# EAGLE design TTGO_shield_revD (EAGLE 9.0.1)
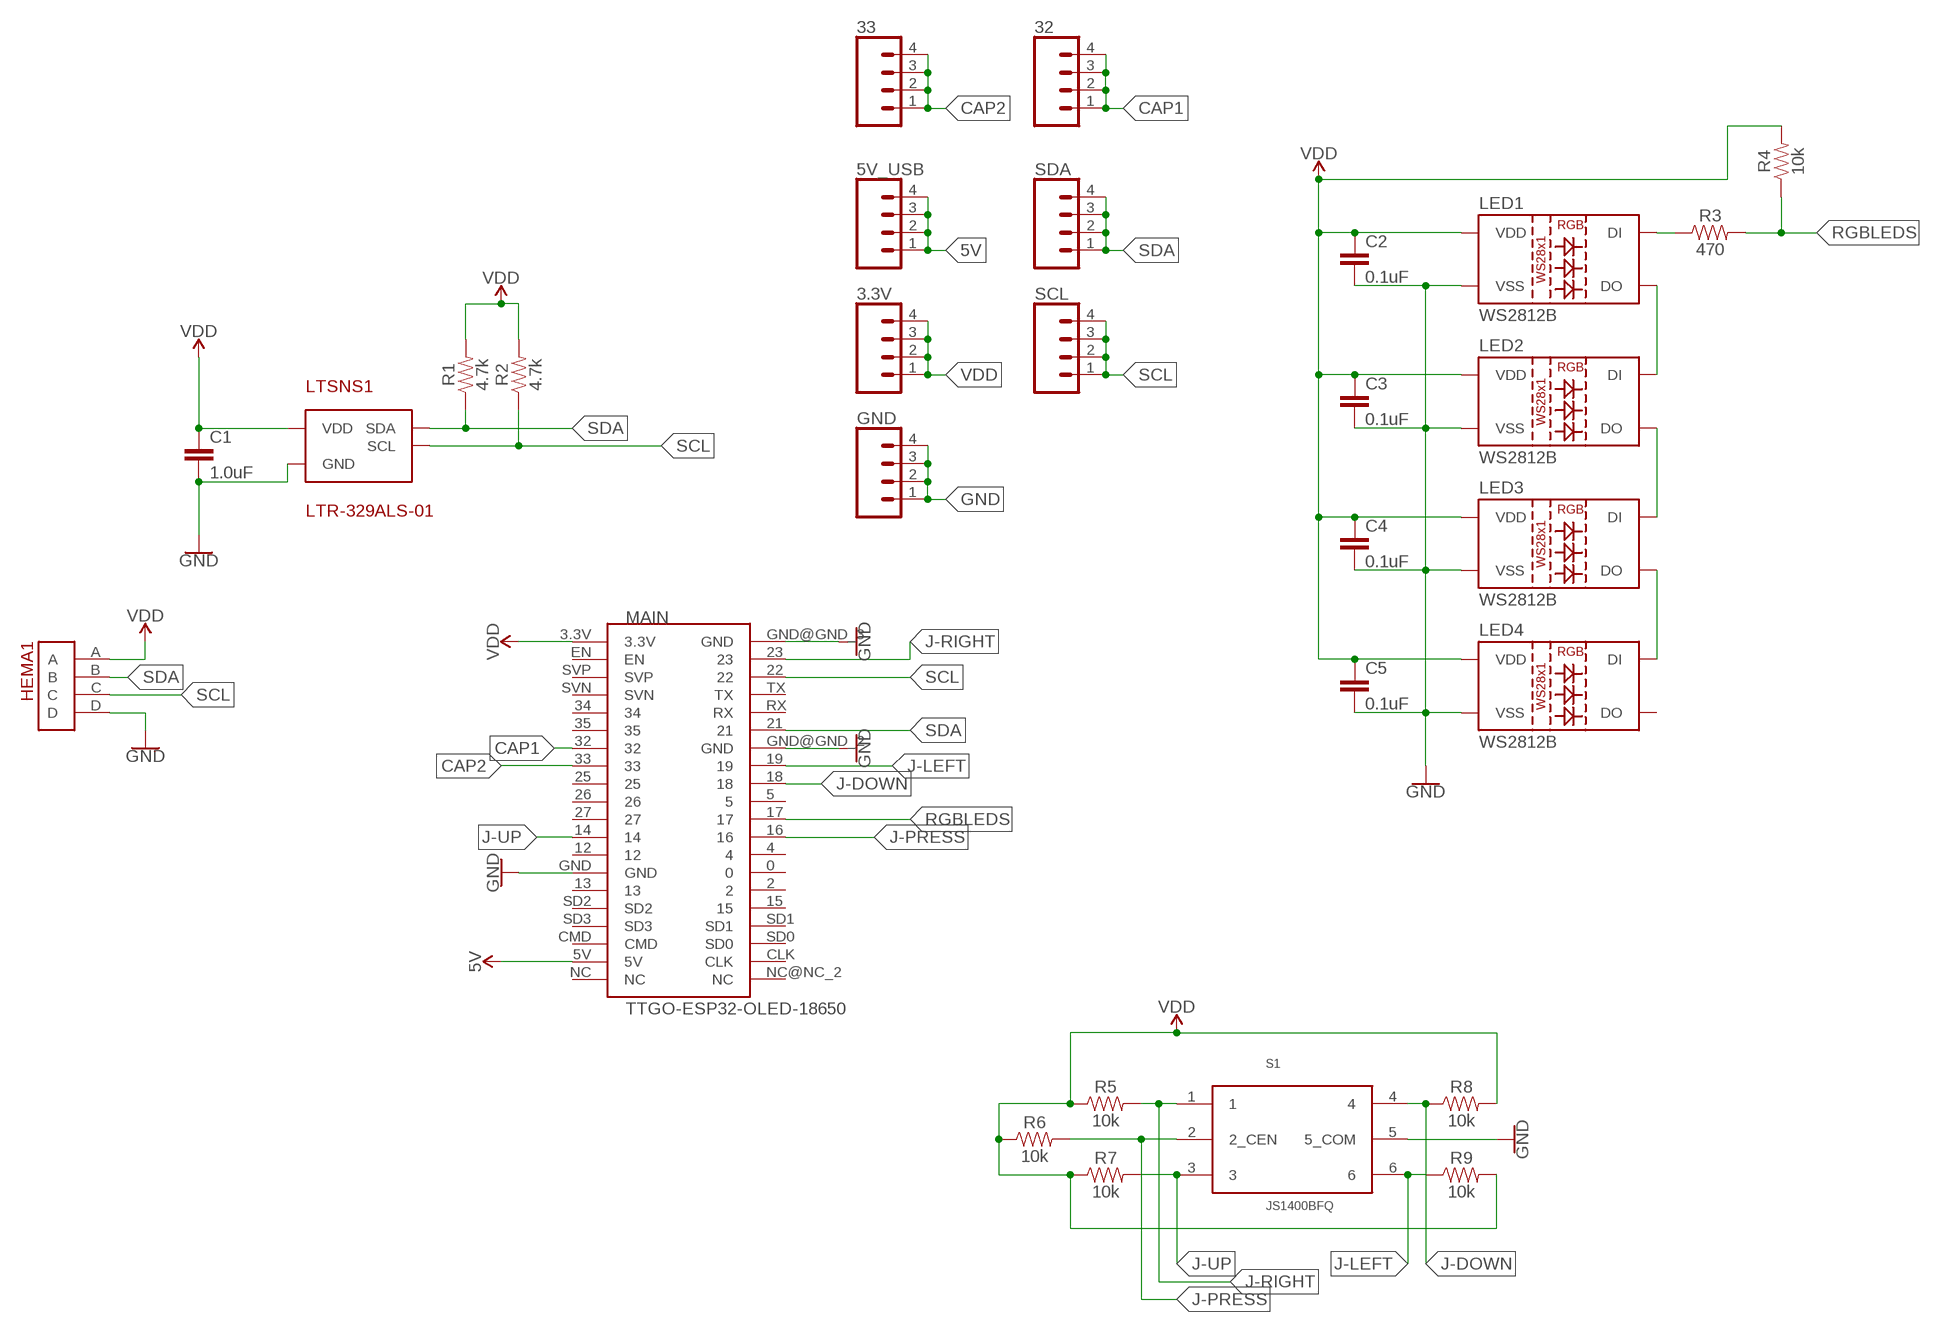
[diagram p0: schematic, sheet 1]

## Parts
3.3V  CONN_041X04_NO_SILK  [1X04_NO_SILK]
5V_USB  CONN_041X04_NO_SILK  [1X04_NO_SILK]
32  CONN_041X04_NO_SILK  [1X04_NO_SILK]
33  CONN_041X04_NO_SILK  [1X04_NO_SILK]
C1  1.0uF  1.0UF-0805-25V-10%  [0805]
C2  0.1uF  0.1UF-0603-25V-5%  [0603]
C3  0.1uF  0.1UF-0603-25V-5%  [0603]
C4  0.1uF  0.1UF-0603-25V-5%  [0603]
C5  0.1uF  0.1UF-0603-25V-5%  [0603]
GND  CONN_041X04_NO_SILK  [1X04_NO_SILK]
HEMA1  10120045-400LF  [10120045-400LF]
LED1  WS2812B  [WS2812B]
LED2  WS2812B  [WS2812B]
LED3  WS2812B  [WS2812B]
LED4  WS2812B  [WS2812B]
LTSNS1  LTR-329ALS-01  [CHIPLED-4]
MAIN  TTGO-ESP32-OLED-18650  [TTGO-ESP32-OLED-18650]
R1  4.7k  4.7KOHM-0603-1/10W-1%  [0603]
R2  4.7k  4.7KOHM-0603-1/10W-1%  [0603]
R3  470  470OHM-0603-1/10W-1%  [0603]
R4  10k  10KOHM-0603-1/10W-1%  [0603]
R5  10k  10KOHM-0603-1/10W-1%  [0603]
R6  10k  10KOHM-0603-1/10W-1%  [0603]
R7  10k  10KOHM-0603-1/10W-1%  [0603]
R8  10k  10KOHM-0603-1/10W-1%  [0603]
R9  10k  10KOHM-0603-1/10W-1%  [0603]
S1  JS1400BFQ  [JS1400BFQ]
SCL  CONN_041X04_NO_SILK  [1X04_NO_SILK]
SDA  CONN_041X04_NO_SILK  [1X04_NO_SILK]

## Nets
5V: 5V_USB.1 5V_USB.2 5V_USB.3 5V_USB.4 MAIN.5V
CAP1: 32.1 32.2 32.3 32.4 MAIN.32
CAP2: 33.1 33.2 33.3 33.4 MAIN.33
GND: C1.2 C2.2 C3.2 C4.2 C5.2 GND.1 GND.2 GND.3 GND.4 HEMA1.D LED1.3(VSS) LED2.3(VSS) LED3.3(VSS) LED4.3(VSS) LTSNS1.2(GND) MAIN.GND MAIN.GND@GND_2(GND) MAIN.GND@GND_3(GND) S1.5(5_COM)
J-DOWN: MAIN.18 R8.1 S1.4
J-LEFT: MAIN.19 R9.1 S1.6
J-PRESS: MAIN.16 R6.2 S1.2(2_CEN)
J-RIGHT: MAIN.23 R5.2 S1.1
J-UP: MAIN.14 R7.2 S1.3
N$9: LED1.2(DO) LED2.4(DI)
N$10: LED2.2(DO) LED3.4(DI)
N$11: LED3.2(DO) LED4.4(DI)
N$12: LED1.4(DI) R3.1
RGBLEDS: MAIN.17 R3.2 R4.1
SCL: HEMA1.C LTSNS1.4(SCL) MAIN.22 R2.1 SCL.1 SCL.2 SCL.3 SCL.4
SDA: HEMA1.B LTSNS1.3(SDA) MAIN.21 R1.1 SDA.1 SDA.2 SDA.3 SDA.4
VDD: 3.3V.1 3.3V.2 3.3V.3 3.3V.4 C1.1 C2.1 C3.1 C4.1 C5.1 HEMA1.A LED1.1(VDD) LED2.1(VDD) LED3.1(VDD) LED4.1(VDD) LTSNS1.1(VDD) MAIN.3.3V R1.2 R2.2 R4.2 R5.1 R6.1 R7.1 R8.2 R9.2
Unconnected: LED4.2(DO) MAIN.0 MAIN.2 MAIN.4 MAIN.5 MAIN.12 MAIN.13 MAIN.15 MAIN.25 MAIN.26 MAIN.27 MAIN.34 MAIN.35 MAIN.CLK MAIN.CMD MAIN.EN MAIN.NC MAIN.NC@NC_2(NC) MAIN.RX MAIN.SD0 MAIN.SD1 MAIN.SD2 MAIN.SD3 MAIN.SVN MAIN.SVP MAIN.TX

## Library data of the parts
3.3V 5V_USB 32 33 GND SCL SDA = SparkFun-Connectors:CONN_04: Multi connection point. Often used as Generic Header-pin footprint for 0.1 inch spaced/style header connections On any of the 0.1 inch spaced packages, you can populate with these: Break Away Headers - Straight <https://www.sparkfun.com/products/116> (PRT-00116) Break Away Male Headers - Right Angle <https://www.sparkfun.com/products/553> (PRT-00553) Female Headers <https://www.sparkfun.com/products/115> (PRT-00115) Break Away Headers - Machine Pin <https://www.sparkfun.com/products/117> (PRT-00117) Break Away Female Headers - Swiss Machine Pin <https://www.sparkfun.com/products/743> (PRT-00743) For SCREWTERMINALS and SPRING TERMINALS visit here: Screw Terimnals on SparkFun.com <https://www.sparkfun.com/search/results?term=Screw+Terminals> (5mm/3.5mm/2.54mm spacing) This device is also useful as a general connection point to wire up your design to another part of your project. Our various solder wires solder well into these plated through hole pads. Hook-Up Wire - Assortment (Stranded, 22 AWG) <https://www.sparkfun.com/products/11375> (PRT-11375) Hook-Up Wire - Assortment (Solid Core, 22 AWG) <https://www.sparkfun.com/products/11367> (PRT-11367) View the entire wire category on our website here <https://www.sparkfun.com/categories/141> Special notes: Molex polarized connector foot print use with SKU : PRT-08231 with associated crimp pins and housings. 1MM SMD Version SKU: PRT-10208; PROD_ID: CONN-09696
C1 = SparkFun-Capacitors:1.0UF: 1µF ceramic capacitors A capacitor is a passive two-terminal electrical component used to store electrical energy temporarily in an electric field.; PROD_ID: CAP-08064
C2-C5 = SparkFun-Capacitors:0.1UF: 0.1µF ceramic capacitors A capacitor is a passive two-terminal electrical component used to store electrical energy temporarily in an electric field.; PROD_ID: CAP-08604
HEMA1 = BadgeParts:10120045-400LF: SSL Connector 4 Position Blade and Receptacle, Hermaphroditic Board to Board 0.118" (3.00mm) Solder Datasheet <https://cdn.amphenol-icc.com/media/wysiwyg/files/drawing/10120045-400lf.pdf>
LED1-LED4 = SparkFun-LED:WS2812B: WS2812B SMD addressable RGB LED 5x5mm SMD LED with built-in controller IC. Color: Red/Green/Blue mC Rating: RGB: 390, 660, 180 mcd Forward Voltage: RGB: 2.0, 3.0, 3.0 V Packages:WS2812B SparkFun Products: Blynk Board - ESP8266 <https://www.sparkfun.com/products/13794>; PROD_ID: DIO-12503
LTSNS1 = NickParts:LTR-329ALS-01
MAIN = BadgeParts:TTGO-ESP32-OLED-18650: Input-only pins: IO34, IO35, Sensor_VP, Sensor_VN, are labeled in docs as GPI (note the lack of O), which may mean they're input-only pins. Pins 4 and 5 go to the OLED SDA/SCL IO32 IO33 are connected to the crystal. Docs say you can't use these 2x pins as GPIO unless you desolder some stuff on the module. There's 5 "strapping" pins, which effect how the ESP-32 boots depending on if they're pulled high or low. So it's possible that something you've hooked upto these pins may effect how it boots. These pins are: 0 2 5 12 15
R1 R2 = SparkFun-Resistors:4.7KOHM: 4.7kΩ resistor A resistor is a passive two-terminal electrical component that implements electrical resistance as a circuit element. Resistors act to reduce current flow, and, at the same time, act to lower voltage levels within circuits. - Wikipedia; PROD_ID: RES-07857
R3 = SparkFun-Resistors:470OHM: 470Ω resistor A resistor is a passive two-terminal electrical component that implements electrical resistance as a circuit element. Resistors act to reduce current flow, and, at the same time, act to lower voltage levels within circuits. - Wikipedia; PROD_ID: RES-07869
R4-R9 = SparkFun-Resistors:10KOHM: 10kΩ resistor A resistor is a passive two-terminal electrical component that implements electrical resistance as a circuit element. Resistors act to reduce current flow, and, at the same time, act to lower voltage levels within circuits. - Wikipedia; PROD_ID: RES-00824
S1 = BadgeParts:JS1400BFQ: 5-way SMD tactile switch

## Board
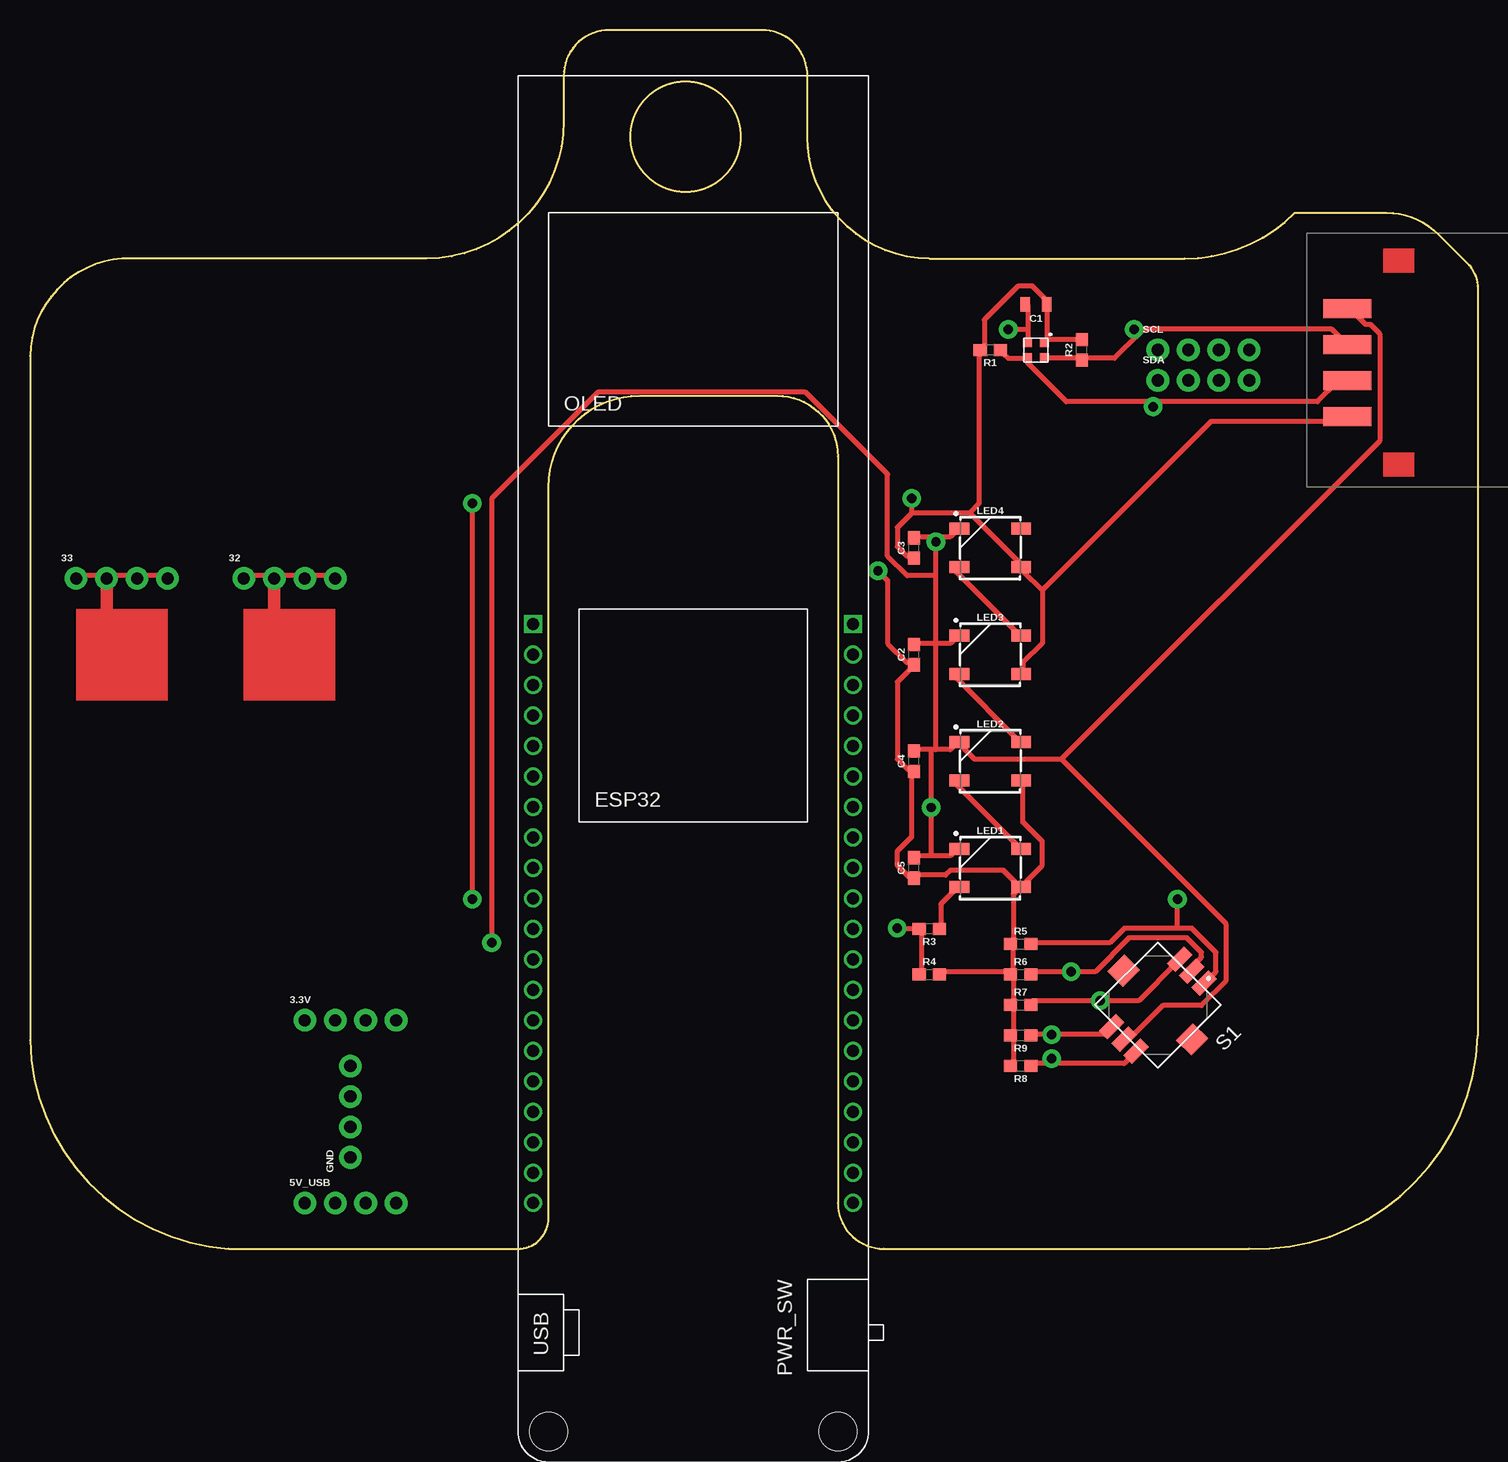
[diagram p1: board, top side]
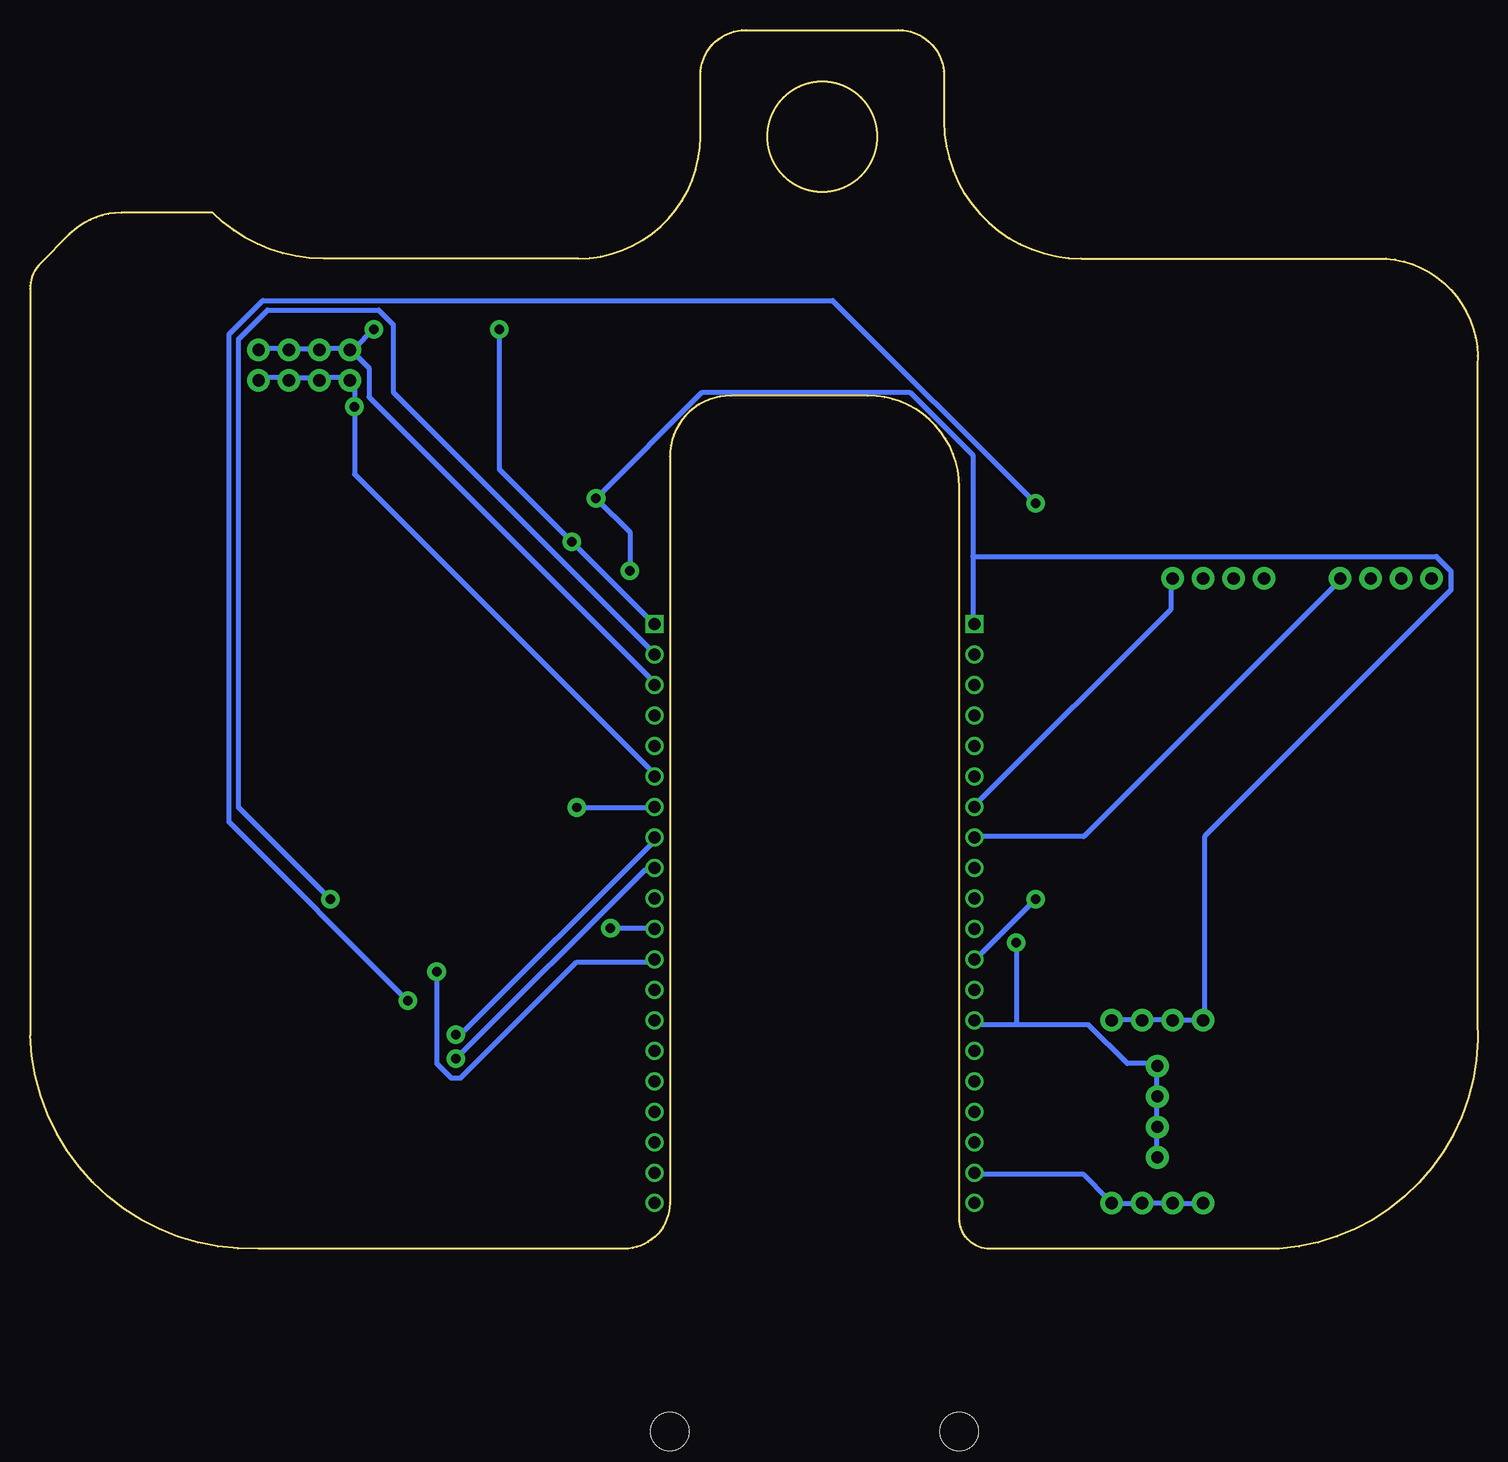
[diagram p2: board, bottom side, seen from below]

Size 120.69 x 101.6 mm. Coordinates in mm from the lower left corner, seen from the top.
Outline: 43.22,2.54 43.22,63.5 arc-90 50.84,71.12 62.27,71.12 arc-90 67.35,66.04 67.35,3.81 arc90 71.16,0 101.64,0 arc90 120.69,17.78 120.69,80.01 arc45 119.79,82.18 117.41,84.56 arc45 113.07,86.36 105.45,86.36 arc-45 96.25,82.55 74.97,82.55 arc-90 64.81,92.71 64.81,97.79 arc90 61,101.6 48.3,101.6 arc90 44.49,97.79 44.49,93.98 arc-90 33.06,82.55 7.66,82.55 arc90 0.04,73.66 0.04,19.05 arc90 16.55,0 40.68,0 arc90 43.22,2.54
Outline: circle at 54.65,92.71 radius 4.58
Copper layers (1*16): Top 0.035mm / dielectric 1.5mm / Bottom 0.035mm
Design rules "OthermillDRC_1_64_v2": minimum track width 16mil, minimum drill 31mil, track to track 0.39878125mm, track to pad 0.39878125mm, pad to pad 0.39878125mm, via to via 0.39878125mm, smd to smd 0mil, copper to edge 0mil, drill to drill 1mil, minimum pad ring 0mil, minimum via ring 15mil, stop-mask expansion 1mil, vias tented up to drill 30mil, thermal gap 10mil
tRestrict: area 39.4,1.3 to 44.5,54.6; area 66.1,1.3 to 71.2,54.6; area 21.6,17.8 to 31.8,20.3; area 25.4,6.4 to 28,16.5; area 21.6,2.5 to 31.8,5.1; area 92.8,71.1 to 102.9,76.2
vRestrict: area 77.5,55.9 to 82.6,61; area 82.6,73.7 to 85.1,76.2; area 77.5,47 to 82.6,52.1; area 77.5,38.1 to 82.6,43.2; area 77.5,29.2 to 82.6,34.3; area 90.2,16.5 to 97.8,24.1; area 106.7,63.5 to 120.7,85.1

### Footprints (pad centres in the part's own frame; a part is rotated, then mirrored left to right if it is on the bottom)
1X04_NO_SILK = drill 1.016 pad 1.88: 1 0,0; 2 2.54,0; 3 5.08,0; 4 7.62,0
0805 = smd 0.8 x 1.2: 1 -0.9,0; 2 0.9,0
0603 = smd 1.1 x 1: 1 -0.85,0; 2 0.85,0
10120045-400LF = smd 1.6 x 4: A 0.8,2; B 3.8,2; C 6.8,2; D 9.8,2
WS2812B = smd 1.651 x 1: 1 2.577,-1.6; 2 2.577,1.6; 3 -2.577,1.6; 4 -2.577,-1.6
CHIPLED-4 = smd 0.7 x 0.75: 1 -0.6,0.7; 2 -0.6,-0.7; 3 0.6,-0.7; 4 0.6,0.7
TTGO-ESP32-OLED-18650 = drill 1: 0 26.67,16.51; 2 26.67,13.97; 4 26.67,19.05; 5 26.67,26.67; 5V 0,3.81; 12 0,19.05; 13 0,13.97; 14 0,21.59; 15 26.67,11.43; 16 26.67,21.59; 17 26.67,24.13; 18 26.67,29.21; 19 26.67,31.75; 21 26.67,36.83; 22 26.67,44.45; 23 26.67,46.99; 25 0,29.21; 26 0,26.67; 27 0,24.13; 32 0,34.29; 33 0,31.75; 34 0,39.37; 35 0,36.83; CLK 26.67,3.81; CMD 0,6.35; EN 0,46.99; GND 0,16.51; GND@GND_2 26.67,34.29; NC 0,1.27; NC@NC_2 26.67,1.27; RX 26.67,39.37; SD0 26.67,6.35; SD1 26.67,8.89; SD2 0,11.43; SD3 0,8.89; SVN 0,41.91; SVP 0,44.45; TX 26.67,41.91 | drill 1 square: 3.3V 0,49.53; GND@GND_3 26.67,49.53 | hole 3.175: 1.27,-17.78; 25.4,-17.78
JS1400BFQ = smd 2 x 1: 1 -4,1.43; 2 -4,0; 3 -4,-1.43; 4 4,1.43; 5 4,0; 6 4,-1.43 | smd 2 x 1.8: P$1 0,4.05; P$2 0,-4.05

### Placement (x,y rotation side)
3.3V  22.9,19.05 0 top
5V_USB  22.9,3.81 0 top
32  17.82,55.88 0 top
33  3.85,55.88 0 top
C1  83.86,78.74 180 top
C2  73.7,49.53 90 top
C3  73.7,58.42 90 top
C4  73.7,40.64 90 top
C5  73.7,31.75 90 top
GND  26.71,7.62 90 top
HEMA1  111.8,68.58 90 top
LED1  80.05,31.75 0 top
LED2  80.05,40.64 0 top
LED3  80.05,49.53 0 top
LED4  80.05,58.42 0 top
LTSNS1  83.86,74.93 270 top
MAIN  41.95,2.54 0 top
R1  80.05,74.93 180 top
R2  87.67,74.93 90 top
R3  74.97,26.67 180 top
R4  74.97,22.86 0 top
R5  82.59,25.4 0 top
R6  82.59,22.86 0 top
R7  82.59,20.32 0 top
R8  82.59,15.24 180 top
R9  82.59,17.78 180 top
S1  94.02,20.32 225 top
SCL  94.02,74.93 0 top
SDA  94.02,72.39 0 top

### Tracks (layer width: path | path; a pad name or v marks a point on that pad's centre or on a via)
5V
  Bottom 0.406: 5V_USB.1 23.18,3.77 25.2,3.77 5V_USB.2 25.6,3.77 27.61,3.77 5V_USB.3 28.01,3.77 30.43,3.77 5V_USB.4 30.83,4.18 32.85,6.19 41.7,6.19 MAIN.5V
CAP1
  Top 0.406: 32.1 17.95,56.11 19.96,56.11 32.2 20.37,56.11 22.78,56.11 32.3 23.18,56.11 25.2,56.11 32.4
  Bottom 0.406: MAIN.32 41.7,37.19 25.6,53.29 25.6,55.71 32.4
CAP2
  Top 0.406: 33.1 3.86,56.11 6.27,56.11 33.2 6.68,56.11 8.69,56.11 33.3 9.09,56.11 11.11,56.11 33.4
  Bottom 0.406: MAIN.33 41.7,34.37 32.85,34.37 11.51,55.71 33.4
GND  (via drill 0.79)
  Top 0.406: 83.17,76.64 83.17,78.66 C1.2 | 83.17,76.64 83.17,75.84 LTSNS1.2 | v81.56,76.64 83.17,76.64 | 75.52,59.33 76.73,59.33 77.13,59.73 LED4.3 | 75.52,59.33 73.91,59.33 C3.2 | 75.52,50.47 76.73,50.47 77.13,50.88 LED3.3 | 75.52,50.47 73.91,50.47 C2.2 | 75.12,32.76 76.73,32.76 77.13,33.16 LED1.3 | 75.12,32.76 73.91,32.76 C5.2 | 75.52,41.62 76.73,41.62 77.13,42.02 LED2.3 77.53,42.02 78.74,40.81 85.99,40.81 | 75.52,41.62 75.12,41.62 | 75.12,41.62 73.91,41.62 C4.2 | 85.99,40.81 99.68,27.12 99.68,22.29 97.66,20.28 94.44,20.28 92.03,17.86 91.22,17.86 S1.5 | 75.12,41.62 v75.12,36.79 75.12,32.76 | 75.52,41.62 75.52,50.47 | 75.52,50.47 75.52,56.11 | 75.52,56.11 v75.52,58.93 75.52,59.33 | 85.99,40.81 112.56,67.38 112.56,76.24 111.75,77.05 111.35,77.05 110.14,78.25 HEMA1.D | v38.48,25.51 38.48,62.55 47.34,71.41 64.65,71.41 71.49,64.56 71.49,57.72 73.1,56.11 75.52,56.11
  Bottom 0.406: v81.56,76.64 81.56,64.97 v75.52,58.93 68.68,52.08 MAIN.GND@GND_3 | GND.1 26.81,7.8 26.81,9.81 GND.2 26.81,10.21 26.81,12.63 GND.3 26.81,13.03 26.81,15.05 GND.4 26.81,15.45 29.22,15.45 32.44,18.67 38.48,18.67 | 38.48,18.67 41.7,18.67 MAIN.GND | v75.12,36.79 68.68,36.79 MAIN.GND@GND_2 | v38.48,25.51 38.48,18.67
J-DOWN  (via drill 0.79)
  Top 0.406: 85.18,15.45 91.22,15.45 92.03,16.25 S1.4 | 85.18,15.45 83.57,15.45 R8.1 | 85.18,15.45 v85.18,15.85
  Bottom 0.406: v85.18,15.85 69.48,31.55 68.68,31.55 MAIN.18
J-LEFT  (via drill 0.79)
  Top 0.406: R9.1 83.57,17.86 v85.18,17.86 89.61,17.86 90.01,18.27 S1.6
  Bottom 0.406: v85.18,17.86 84.78,17.86 68.68,33.97 MAIN.19
J-PRESS  (via drill 0.79)
  Top 0.406: R6.2 83.57,23.1 v86.79,23.1 88.81,23.1 91.62,25.92 96.45,25.92 97.66,24.71 97.66,24.31 96.86,23.5 S1.2
  Bottom 0.406: v86.79,23.1 86.79,15.45 85.58,14.24 84.78,14.24 75.12,23.9 68.68,23.9 MAIN.16
J-RIGHT  (via drill 0.79)
  Top 0.406: 95.65,26.72 96.86,26.72 98.87,24.71 98.87,23.1 98.07,22.29 S1.1 | 95.65,26.72 91.22,26.72 90.01,25.51 83.57,25.51 R5.2 | 95.65,26.72 v95.65,29.14
  Bottom 0.406: v95.65,29.14 103.3,36.79 103.3,75.84 100.88,78.25 91.62,78.25 90.42,77.05 90.42,71.41 68.68,49.67 MAIN.23
J-UP  (via drill 0.79)
  Top 0.406: R7.2 83.57,20.68 v89.21,20.68 92.43,20.68 95.65,23.9 S1.3 | v36.87,62.15 v36.87,29.14
  Bottom 0.406: v36.87,29.14 41.7,24.31 MAIN.14 | v36.87,62.15 53.78,79.06 101.29,79.06 104.1,76.24 104.1,35.58 v89.21,20.68
N$9
  Top 0.406: LED1.2 82.36,33.56 77.13,38.8 LED2.4
N$10
  Top 0.406: LED2.2 82.36,42.42 77.13,47.66 LED3.4
N$11
  Top 0.406: LED3.2 82.36,51.28 77.13,56.51 LED4.4
N$12
  Top 0.406: R3.1 75.92,26.72 75.92,28.73 77.13,29.94 LED1.4
RGBLEDS  (via drill 0.79)
  Top 0.406: R4.1 74.31,23.1 74.31,26.32 R3.2 73.91,26.72 v72.3,26.72
  Bottom 0.406: v72.3,26.72 68.68,26.72 MAIN.17
SCL  (via drill 0.79)
  Top 0.406: LTSNS1.4 84.78,74.23 87.6,74.23 R2.1 88,74.23 90.42,74.23 92.43,76.24 | 92.43,76.24 92.83,76.64 108.53,76.64 109.74,75.43 HEMA1.C | v92.03,76.64 92.43,76.24
  Bottom 0.406: SCL.4 101.29,75.03 99.27,75.03 SCL.3 98.87,75.03 96.86,75.03 SCL.2 96.45,75.03 94.04,75.03 SCL.1 | MAIN.22 68.68,47.25 92.43,71.01 92.43,73.42 93.64,74.63 SCL.1 | v92.03,76.64 93.64,75.03 SCL.1
SDA  (via drill 0.79)
  Top 0.406: 83.17,74.23 81.56,74.23 81.16,74.63 R1.1 | 83.17,74.23 83.17,73.82 86.39,70.6 93.64,70.6 | 93.64,70.6 107.32,70.6 108.94,72.21 109.74,72.21 HEMA1.B | 83.17,74.23 LTSNS1.3 | v93.64,70.2 93.64,70.6
  Bottom 0.406: SDA.4 101.29,72.62 99.27,72.62 SDA.3 98.87,72.62 96.86,72.62 SDA.2 96.45,72.62 94.04,72.62 SDA.1 93.64,72.21 v93.64,70.2 93.64,64.56 68.68,39.6 MAIN.21
VDD  (via drill 0.79)
  Top 0.406: R8.2 81.96,15.45 81.96,17.46 R9.2 81.96,17.86 81.96,20.28 R7.1 81.96,20.68 81.96,22.69 R6.1 | R4.2 75.92,23.1 81.56,23.1 R6.1 | R6.1 81.96,23.1 81.96,25.11 R5.1 81.96,25.51 81.96,29.54 82.36,29.94 LED1.1 | LED1.1 82.36,30.34 81.16,31.55 76.73,31.55 76.33,31.15 73.91,31.15 C5.1 73.51,30.75 72.3,31.96 72.3,33.16 73.51,34.37 73.51,39.6 C4.1 73.51,40.01 73.1,40.01 72.3,40.81 72.3,47.25 73.51,48.46 C2.1 73.51,48.86 73.1,48.86 71.49,50.47 71.49,55.71 v70.69,56.51 | LED2.1 82.77,38.8 82.77,35.58 84.38,33.97 84.38,31.96 82.77,30.34 LED1.1 | 84.78,75.84 84.78,78.66 C1.1 84.78,79.06 83.57,80.27 82.36,80.27 79.55,77.45 79.55,75.03 R1.2 79.14,74.63 79.14,62.15 78.34,61.34 | 84.78,75.84 87.6,75.84 R2.2 | 84.78,75.84 LTSNS1.1 | 73.51,61.34 72.3,60.14 72.3,58.53 73.1,57.72 73.51,57.72 C3.1 | 78.34,61.34 73.51,61.34 | 78.34,61.34 82.77,56.91 LED4.1 82.77,56.51 84.38,54.9 | 84.38,54.9 84.38,50.47 82.77,48.86 82.77,48.06 LED3.1 | 73.51,61.34 v73.51,62.55 | 84.38,54.9 98.47,68.99 109.74,68.99 HEMA1.A
  Bottom 0.406: 3.3V.4 30.43,19.07 28.01,19.07 3.3V.3 27.61,19.07 25.6,19.07 3.3V.2 25.2,19.07 23.18,19.07 3.3V.1 22.78,19.07 22.78,34.37 2.25,54.9 2.25,56.51 3.46,57.72 42.11,57.72 | 42.11,57.72 42.11,66.17 47.34,71.41 64.65,71.41 v73.51,62.55 70.69,59.73 v70.69,56.51 | 42.11,57.72 42.11,52.08 MAIN.3.3V
(copper drawn outside any net)
  shapes: Top area x4